# EasyEDA schematic preamp_transistor.json
TITLE: Sheet_1; REV: 1.0; Date: 2023-10-23; Sheet: 1/1; Company: Your Company
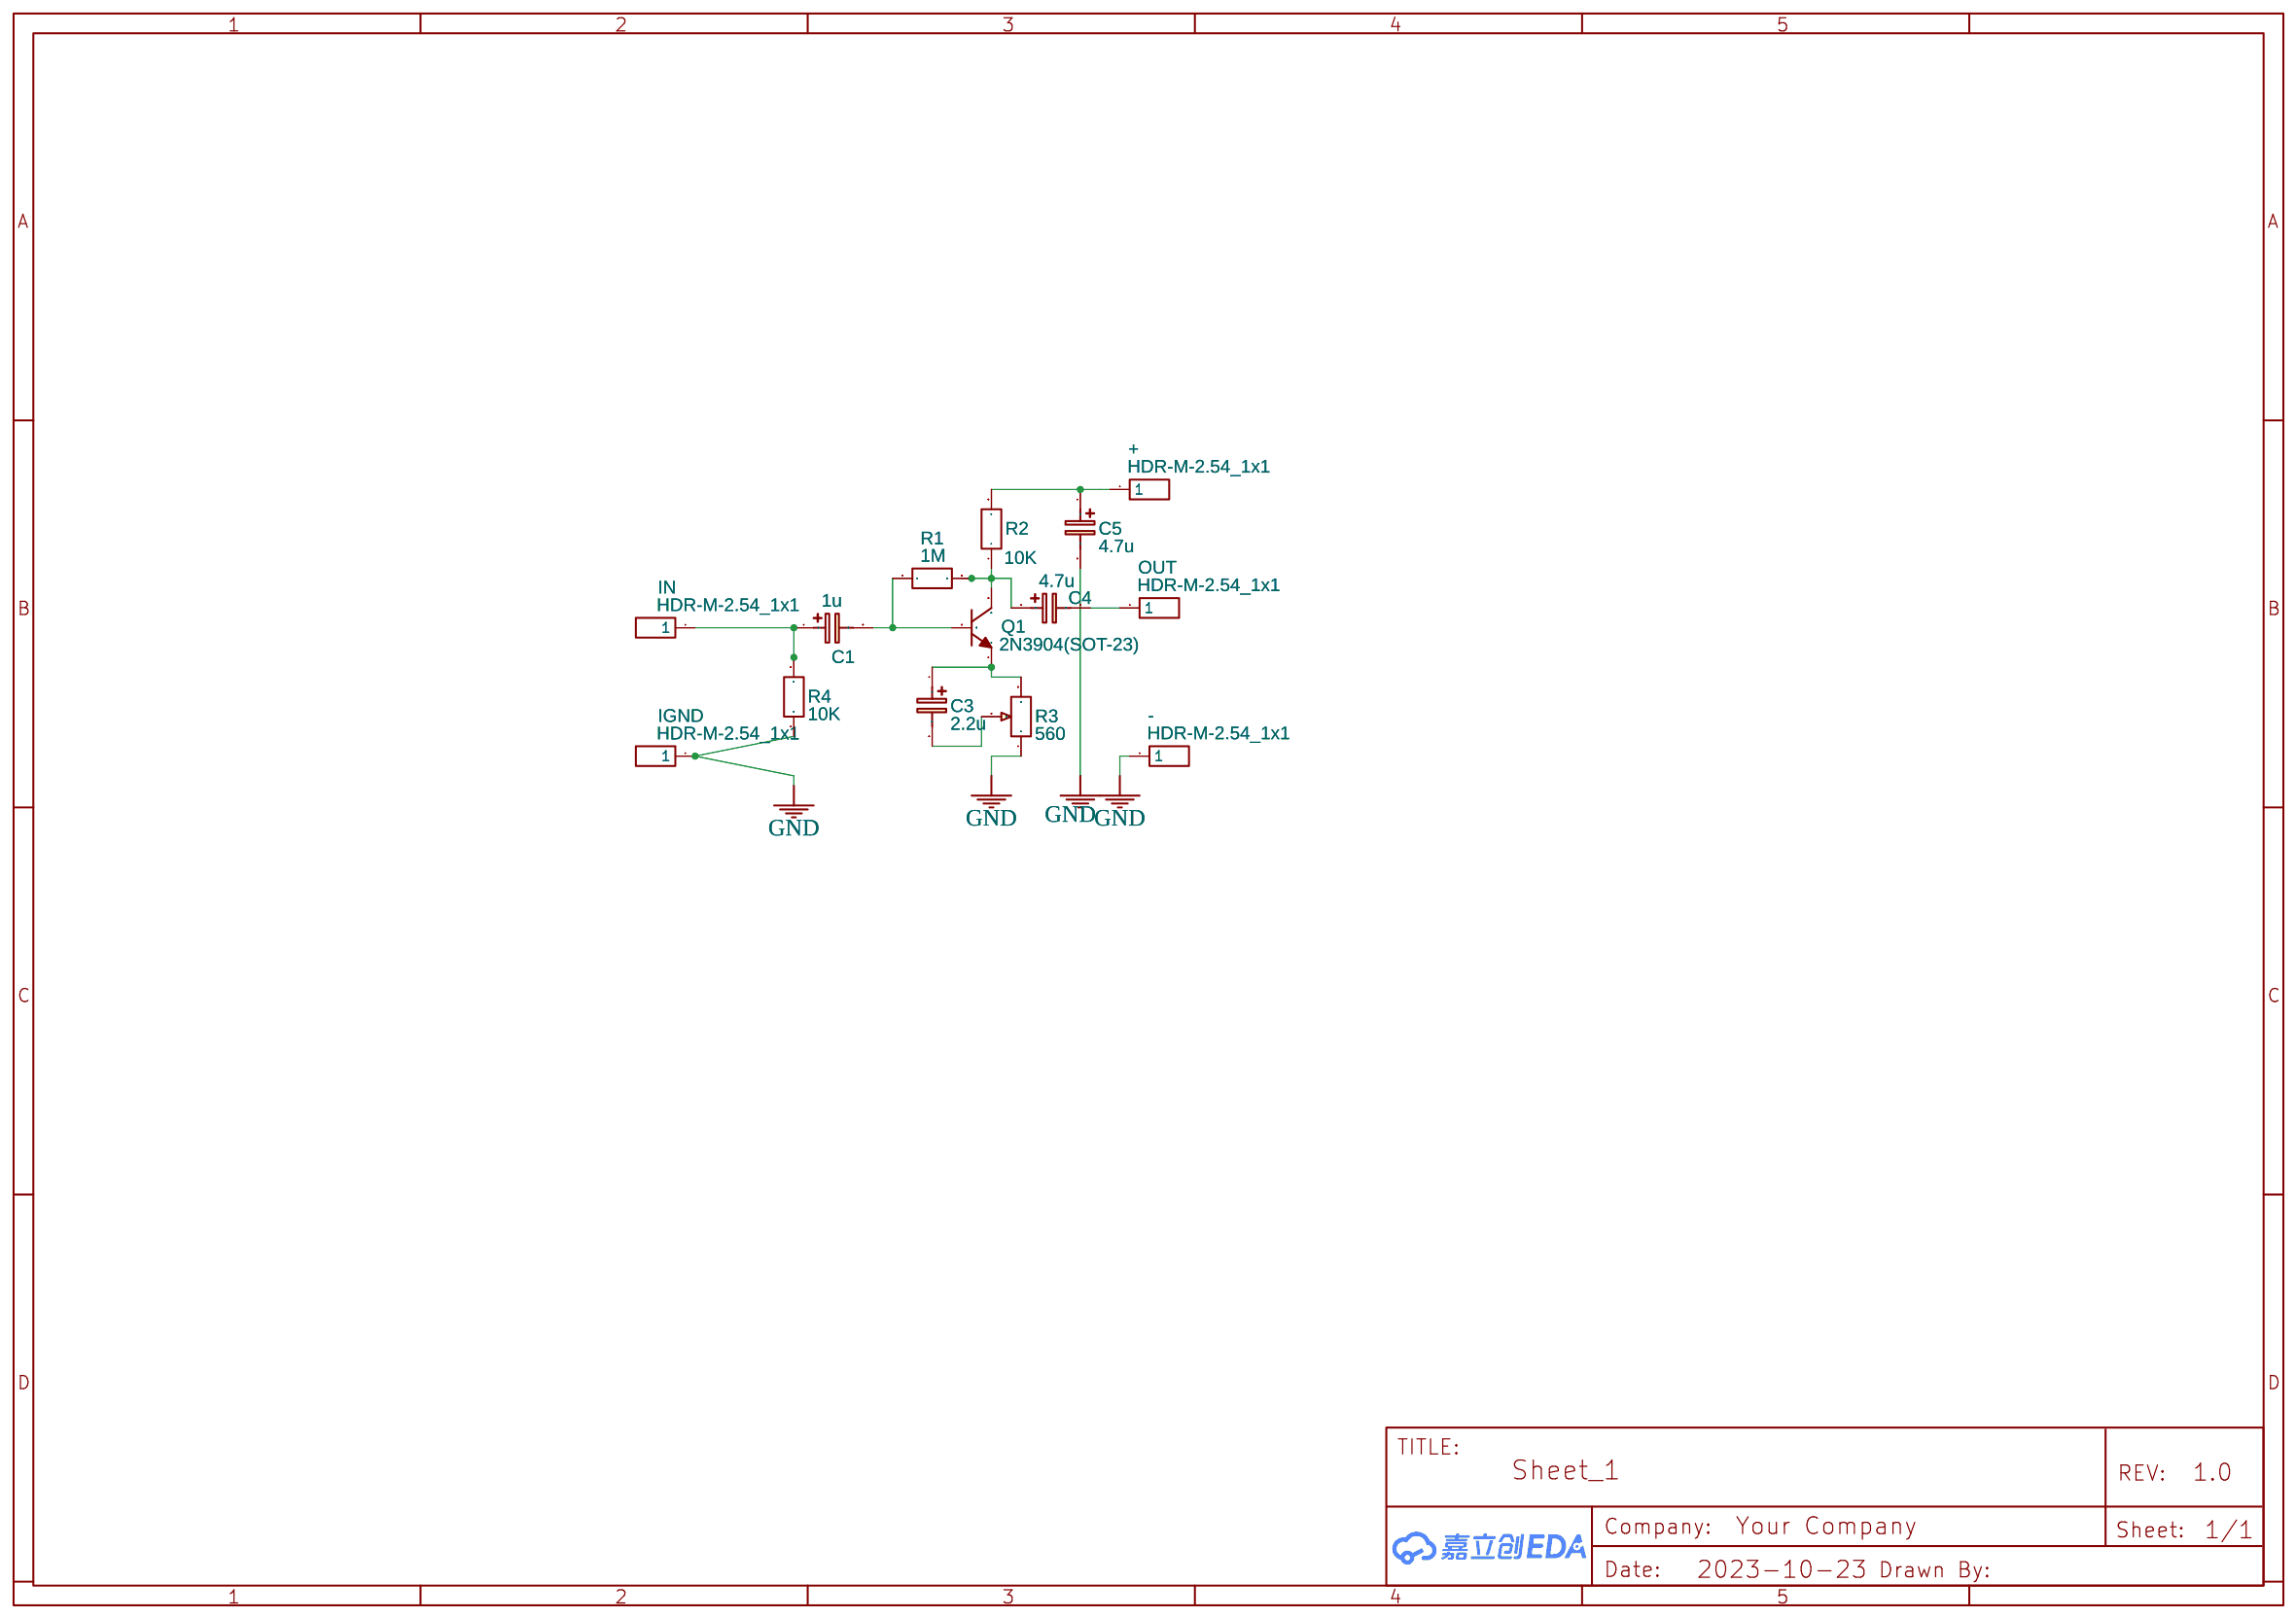
[diagram p0: schematic sheet]

## Parts
+  HDR-M-2.54_1x1  [HDR-M-2.54_1X1]
-  HDR-M-2.54_1x1  [HDR-M-2.54_1X1]
C1  1u  [CPOL-RADIAL-100UF-25V]
C3  2.2u  [CPOL-RADIAL-100UF-25V]
C4  4.7u  [CPOL-RADIAL-100UF-25V]
C5  4.7u  [CPOL-RADIAL-10UF-25V]
IGND  HDR-M-2.54_1x1  [HDR-M-2.54_1X1]
IN  HDR-M-2.54_1x1  [HDR-M-2.54_1X1]
OUT  HDR-M-2.54_1x1  [HDR-M-2.54_1X1]
Q1  2N3904(SOT-23)  [TO92-I]
R1  1M  [R_AXIAL-0.4]
R2  10K  [R_AXIAL-0.4]
R3  560  [RES-ADJ-TH_RM063-103]
R4  10K  [R_AXIAL-0.4]

## Library data of the parts
+ - IGND IN OUT = HDR-M-2.54_1x1: Supplier Part: C81276; Supplier: LCSC; Contributor: LCEDA_Lib
C1 C3 C4 = C_Tan_SMD_A_EU: Contributor: LCEDA_Lib
C5 = C_Tan_SMD_A_EU: Contributor: LCEDA_Lib; Package Display: No
Q1 = 2N3904(SOT-23): Supplier: LCSC; Manufacturer: KEC; Manufacturer Part: 2n3904S-RTK/PS; Supplier Part: C18536; Paste Type: SOT-23; Contributor: LCEDA_Lib
R1 R2 R4 = R_0603_EU: Contributor: LCEDA_Lib
R3 = RM063-103 10K: Supplier: LCSC; Manufacturer: JML; Supplier Part: C38793

## Nets
GND: -.1 C5.2 IGND.1 R3.1 R4.1
Net-(+-1): +.1 C5.1 R2.2
Net-(C1-1): C1.1 IN.1 R4.2
Net-(C1-2): C1.2 Q1.2(B) R1.1
Net-(C3-1): C3.1 Q1.1(E) R3.3
Net-(C3-2): C3.2 R3.2
Net-(C4-1): C4.1 Q1.3(C) R1.2 R2.1
Net-(C4-2): C4.2 OUT.1
